# EAGLE design nixieDriver-v1 (EAGLE 5.06)
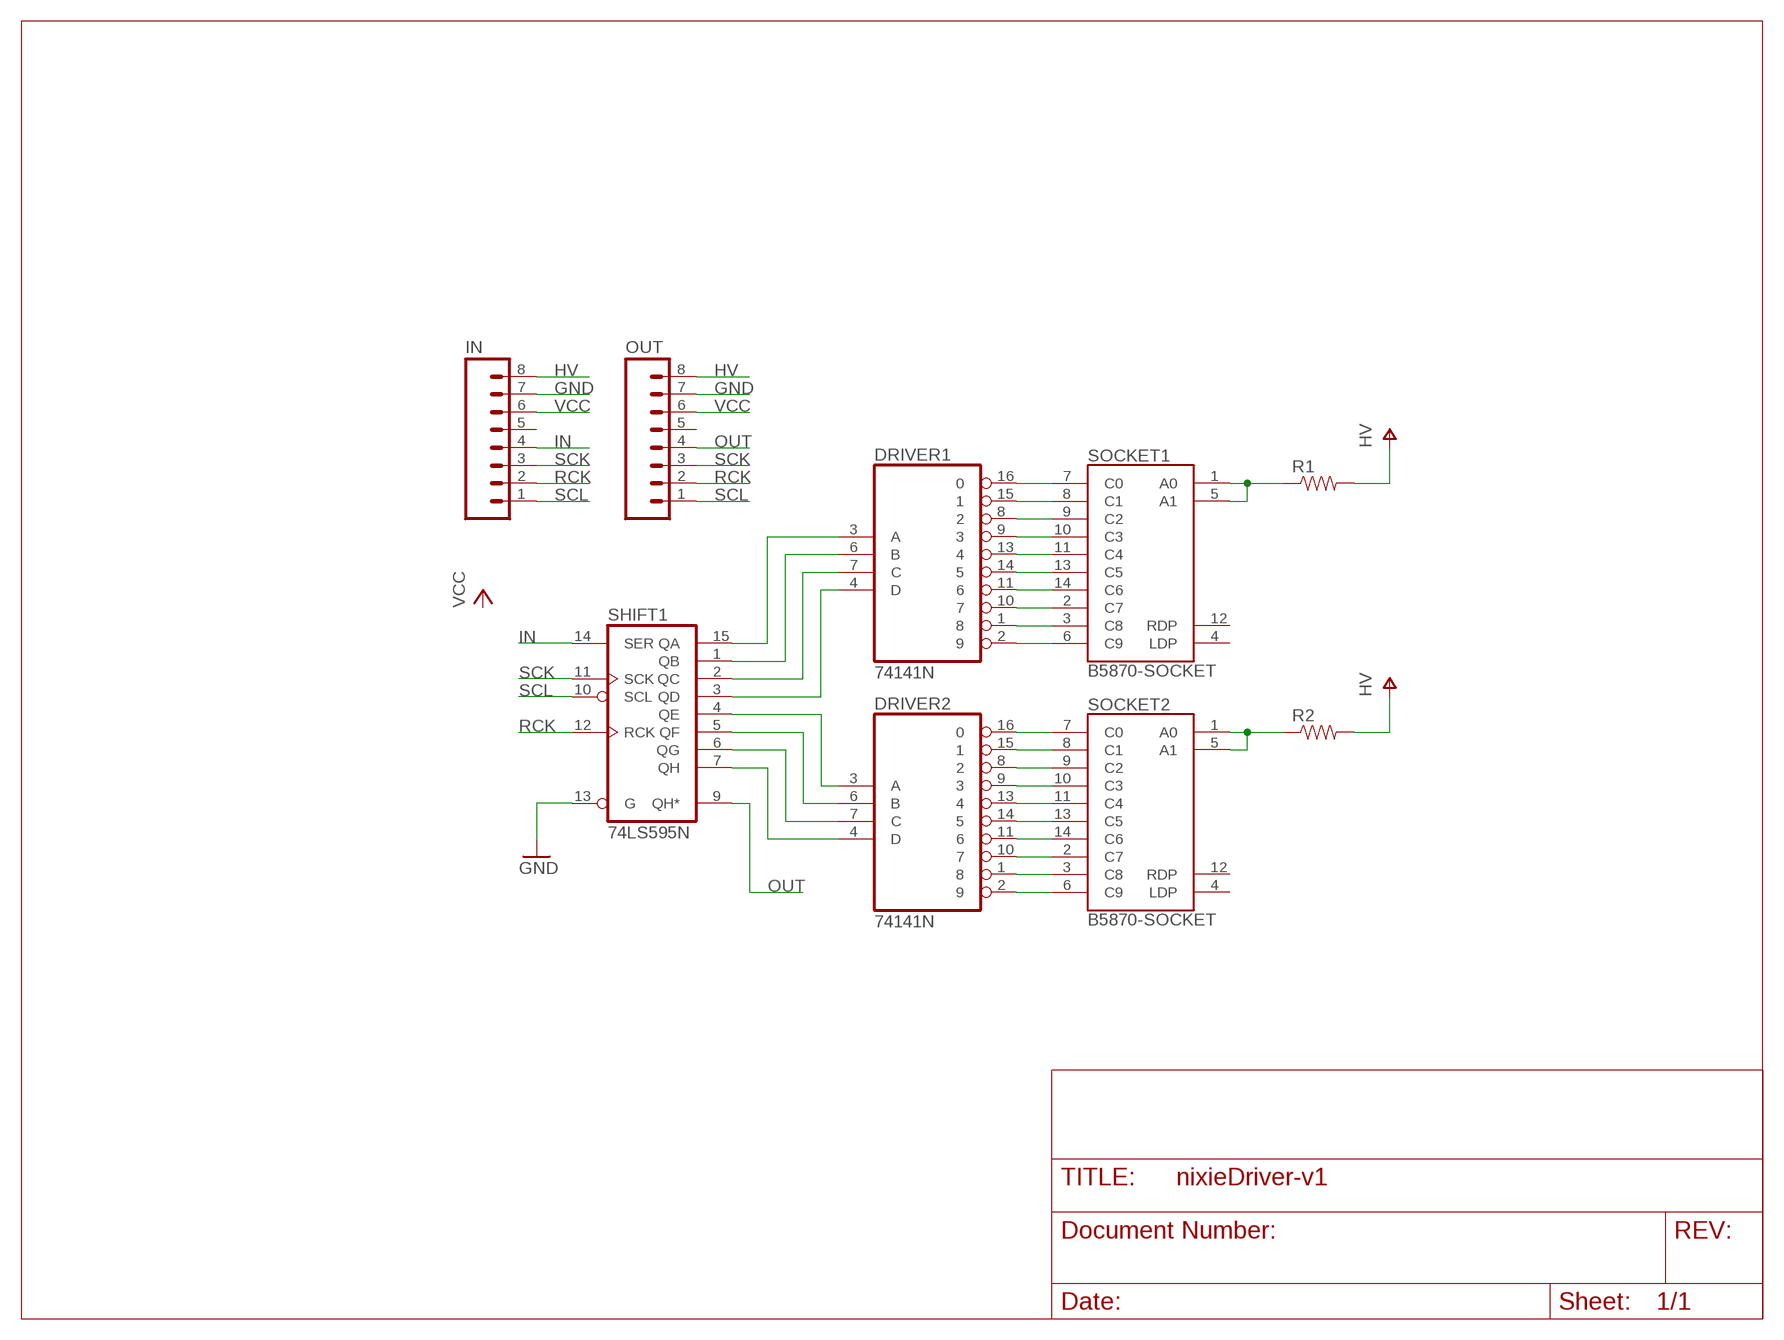
[diagram p0: schematic, sheet 1]

## Parts
DRIVER1  74141N  [DIL16]
DRIVER2  74141N  [DIL16]
IN  M08  [1X08]
OUT  M08  [1X08]
R1  RESISTORPTH1  [AXIAL-0.3]
R2  RESISTORPTH1  [AXIAL-0.3]
SHIFT1  74LS595N  [DIL16]
SOCKET1  B5870-SOCKET  [B5870-SOCKET]
SOCKET2  B5870-SOCKET  [B5870-SOCKET]

## Nets
GND: IN.7 OUT.7 SHIFT1.13(G)
HV: IN.8 OUT.8 R1.P$2 R2.P$2
IN: IN.4 SHIFT1.14(SER)
N$1: DRIVER1.3(A) SHIFT1.15(QA)
N$2: DRIVER1.6(B) SHIFT1.1(QB)
N$3: DRIVER1.7(C) SHIFT1.2(QC)
N$4: DRIVER1.4(D) SHIFT1.3(QD)
N$5: DRIVER2.3(A) SHIFT1.4(QE)
N$6: DRIVER2.6(B) SHIFT1.5(QF)
N$7: DRIVER2.7(C) SHIFT1.6(QG)
N$8: DRIVER2.4(D) SHIFT1.7(QH)
N$9: DRIVER1.16 SOCKET1.7(C0)
N$10: DRIVER1.15 SOCKET1.8(C1)
N$11: DRIVER1.8 SOCKET1.9(C2)
N$12: DRIVER1.9 SOCKET1.10(C3)
N$13: DRIVER1.13 SOCKET1.11(C4)
N$14: DRIVER1.14 SOCKET1.13(C5)
N$15: DRIVER1.11 SOCKET1.14(C6)
N$16: DRIVER1.10 SOCKET1.2(C7)
N$17: DRIVER1.1 SOCKET1.3(C8)
N$18: DRIVER1.2 SOCKET1.6(C9)
N$19: R2.P$1 SOCKET2.1(A0) SOCKET2.5(A1)
N$20: R1.P$1 SOCKET1.1(A0) SOCKET1.5(A1)
N$21: DRIVER2.16 SOCKET2.7(C0)
N$22: DRIVER2.15 SOCKET2.8(C1)
N$23: DRIVER2.8 SOCKET2.9(C2)
N$24: DRIVER2.9 SOCKET2.10(C3)
N$25: DRIVER2.13 SOCKET2.11(C4)
N$26: DRIVER2.14 SOCKET2.13(C5)
N$27: DRIVER2.11 SOCKET2.14(C6)
N$28: DRIVER2.10 SOCKET2.2(C7)
N$29: DRIVER2.1 SOCKET2.3(C8)
N$30: DRIVER2.2 SOCKET2.6(C9)
OUT: OUT.4 SHIFT1.9(QH*)
RCK: IN.2 OUT.2 SHIFT1.12(RCK)
SCK: IN.3 OUT.3 SHIFT1.11(SCK)
SCL: IN.1 OUT.1 SHIFT1.10(SCL)
VCC: IN.6 OUT.6
Unconnected: IN.5 OUT.5 SOCKET1.4(LDP) SOCKET1.12(RDP) SOCKET2.4(LDP) SOCKET2.12(RDP)

## Power pins joined to a net without a drawn wire
GND: DRIVER1.12(GND) DRIVER2.12(GND) SHIFT1.8(GND)
VCC: DRIVER1.5(VCC) DRIVER2.5(VCC) SHIFT1.16(VCC)

## Library data of the parts
DRIVER1 DRIVER2 = 74xx-us:74*141: BCD to decimal DECODER/DRIVER
IN OUT = SparkFun:M08: Header 8 Standard 8-pin 0.1" header. Use with straight break away headers (SKU : PRT-00116), right angle break away headers (PRT-00553), swiss pins (PRT-00743), machine pins (PRT-00117), and female headers (PRT-00115).
R1 R2 = SparkFun:RESISTOR: Resistor Basic schematic elements and footprints for 0603, 1206, and PTH 1/10th watt (small) resistors.
SHIFT1 = 74xx-us:74*595: 8-bit SHIFT REGISTER, output latch
SOCKET1 SOCKET2 = ungood:B5870-SOCKET: Custom-made socket for Burroughs 5870 series Nixie tubes

## Board
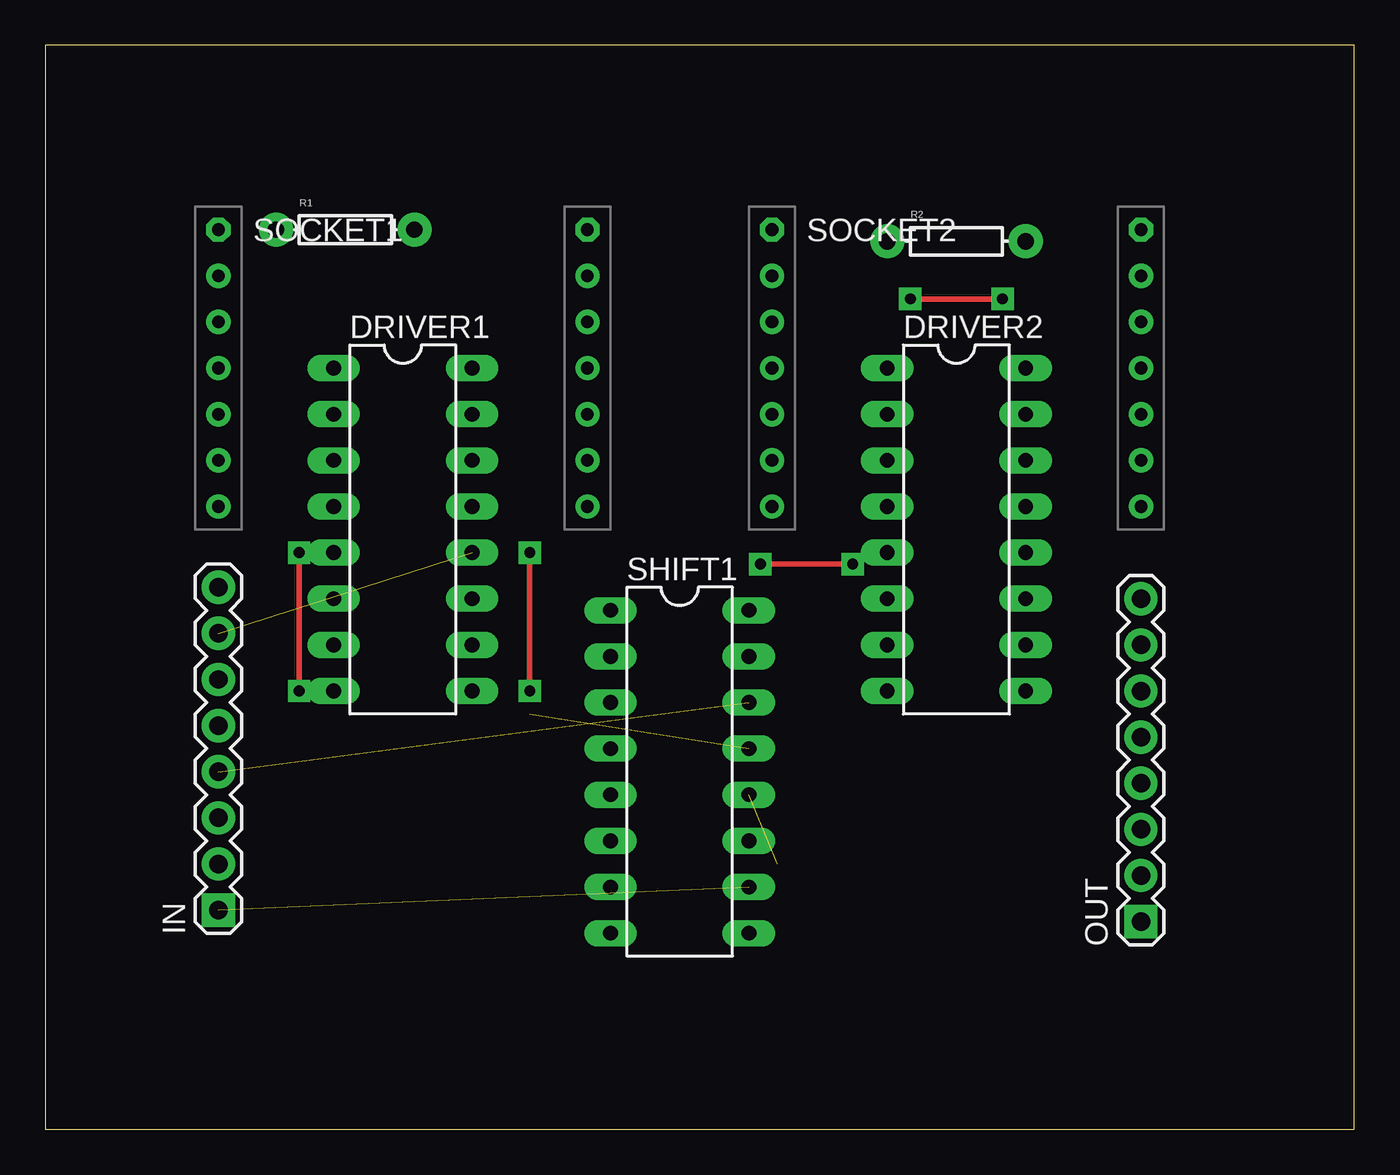
[diagram p1: board, top side]
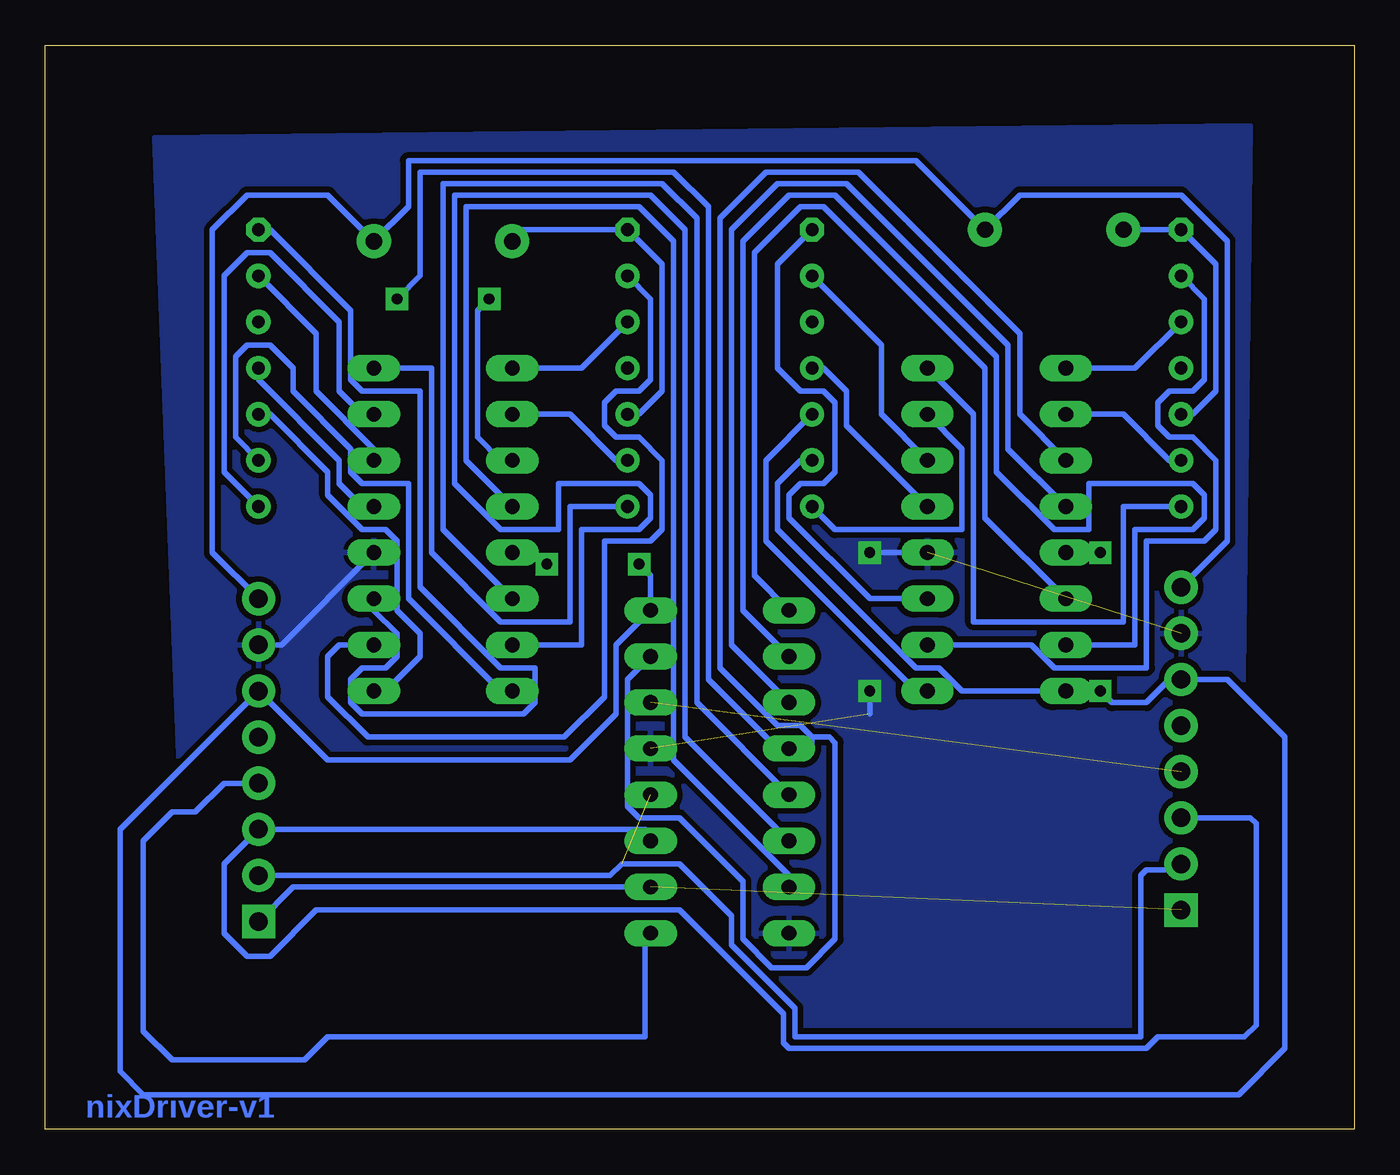
[diagram p2: board, bottom side, seen from below]

Size 72.06 x 59.68 mm. Coordinates in mm from the lower left corner, seen from the top.
Outline: 0,0 72.06,0 72.06,59.68 0,59.68 0,0
Copper layers (1*16): Top 0.035mm / dielectric 1.5mm / Bottom 0.035mm
Design rules "homebrew": minimum track width 12mil, minimum drill 25mil, track to track 12.5mil, track to pad 12.5mil, pad to pad 12.5mil, via to via 12.5mil, smd to smd 8mil, copper to edge 40mil, drill to drill 8mil, minimum pad ring 12.5mil, minimum via ring 12.5mil, stop-mask expansion 4mil, vias tented up to drill 0mil, thermal gap 10mil

### Footprints (pad centres in the part's own frame; a part is rotated, then mirrored left to right if it is on the bottom)
DIL16 = drill 0.813 long: 1 -8.89,-3.81; 2 -6.35,-3.81; 3 -3.81,-3.81; 4 -1.27,-3.81; 5 1.27,-3.81; 6 3.81,-3.81; 7 6.35,-3.81; 8 8.89,-3.81; 9 8.89,3.81; 10 6.35,3.81; 11 3.81,3.81; 12 1.27,3.81; 13 -1.27,3.81; 14 -3.81,3.81; 15 -6.35,3.81; 16 -8.89,3.81
1X08 = drill 1.016 pad 1.829 square: 1 0,0 | drill 1.016 pad 1.829 round: 2 2.54,0; 3 5.08,0; 4 7.62,0; 5 10.16,0; 6 12.7,0; 7 15.24,0; 8 17.78,0
AXIAL-0.3 = drill 0.9 pad 1.88 round: P$1 -3.81,0; P$2 3.81,0
B5870-SOCKET = drill 0.7 octagon: 1 -10.16,7.62; 14 10.16,7.62 | drill 0.7 round: 2 -10.16,5.08; 3 -10.16,2.54; 4 -10.16,0; 5 -10.16,-2.54; 6 -10.16,-5.08; 7 -10.16,-7.62; 8 10.16,-7.62; 9 10.16,-5.08; 10 10.16,-2.54; 11 10.16,0; 12 10.16,2.54; 13 10.16,5.08

### Placement (x,y rotation side)
DRIVER1  19.69,33.02 270 top
DRIVER2  50.16,33.02 270 top
IN  9.53,12.06 90 top
OUT  60.32,11.43 90 top
R1  16.51,49.53 0 top
R2  50.16,48.9 0 top
SHIFT1  34.92,19.69 270 top
SOCKET1  19.69,41.91 0 top
SOCKET2  50.16,41.91 0 top

### Tracks (layer width: path | path; a pad name or v marks a point on that pad's centre or on a via)
GND  (via drill 0.6)  (2 unrouted)
  Top 0.305: v26.67,24.13 v26.67,31.75
  Bottom 0.305: v26.67,31.75 DRIVER1.12 | v26.67,24.13 26.67,22.86 | DRIVER2.12 59.05,26.67 OUT.7
  pour Bottom (isolate 0.305): 5.71,55.24 66.04,54.61 64.14,5.71 6.35,5.71
HV
  Bottom 0.305: IN.8 6.98,32.38 6.98,48.9 9.53,51.43 18.42,51.43 R1.P$2 24.13,53.34 52.07,53.34 52.07,50.8 R2.P$2 56.52,51.43 60.96,51.43 62.86,49.53 62.86,31.75 OUT.8
IN  (1 unrouted)
N$1
  Bottom 0.305: DRIVER1.3 18.42,39.37 18.42,43.82 27.31,52.71 32.38,52.71 34.92,50.16 34.92,25.4 31.75,22.23 30.48,22.23 29.85,21.59 | 29.85,21.59 29.85,21.27 | 29.85,21.59 28.89,21.59 28.58,21.27 28.58,10.48 30.16,8.89 32.07,8.89 33.66,10.48 33.66,13.65 37.15,17.15 39.37,17.15 40,17.78 40,24.77 SHIFT1.15
N$2
  Bottom 0.305: DRIVER1.6 20.32,33.66 20.32,41.91 29.21,50.8 30.48,50.8 33.02,48.26 33.02,30.48 SHIFT1.1
N$3
  Bottom 0.305: DRIVER1.7 12.06,26.67 12.06,33.02 8.89,33.02 8.26,33.66 8.26,34.92 8.89,35.56 14.61,35.56 14.61,33.02 16.51,33.02 19.69,36.2 19.69,42.55 28.58,51.43 31.12,51.43 33.66,48.9 33.66,28.58 SHIFT1.2
N$4
  Bottom 0.305: SHIFT1.3 34.29,26.67 34.29,49.53 31.75,52.07 27.94,52.07 19.05,43.18 19.05,37.46 DRIVER1.4
N$5  (via drill 0.6)
  Top 0.305: v52.7,45.72 v47.62,45.72
  Bottom 0.305: DRIVER2.3 46.99,36.83 48.26,38.1 48.26,45.09 v47.62,45.72 | SHIFT1.4 31.75,20.95 35.56,24.77 35.56,50.8 37.46,52.71 51.43,52.71 51.43,46.99 v52.7,45.72
N$6
  Bottom 0.305: DRIVER2.6 50.16,33.02 50.16,52.07 38.1,52.07 36.2,50.16 36.2,23.49 SHIFT1.5
N$7
  Bottom 0.305: DRIVER2.7 42.54,26.67 42.54,33.02 39.37,33.02 38.73,33.66 38.73,34.92 39.37,35.56 43.81,35.56 43.81,33.02 46.99,33.02 49.53,35.56 49.53,51.43 38.73,51.43 36.83,49.53 36.83,21.59 SHIFT1.6
N$8
  Bottom 0.305: DRIVER2.4 48.89,36.83 48.89,50.8 39.37,50.8 37.46,48.9 37.46,20.32 31.12,13.97 SHIFT1.7
N$9
  Bottom 0.305: SOCKET1.7 12.7,34.29 12.7,27.94 20.96,27.94 20.96,39.37 DRIVER1.16
N$10
  Bottom 0.305: DRIVER1.15 21.59,37.46 21.59,33.02 28.58,33.02 SOCKET1.8
N$11
  Bottom 0.305: SOCKET1.9 30.48,36.83 31.75,35.56 31.75,33.02 24.13,25.4 22.86,25.4 21.59,24.13 DRIVER1.8
N$12
  Bottom 0.305: DRIVER1.9 24.13,24.13 32.38,32.38 32.38,36.83 SOCKET1.10
N$13
  Bottom 0.305: DRIVER1.13 27.94,38.73 27.94,40.64 29.21,41.91 SOCKET1.11
N$14
  Bottom 0.305: DRIVER1.14 26.04,39.37 26.04,43.18 SOCKET1.13
N$15
  Bottom 0.305: SOCKET1.14 31.75,47.62 31.75,41.91 30.48,40.64 29.21,40.64 28.58,40.01 28.58,36.2 29.21,35.56 30.48,35.56 31.12,34.92 31.12,33.66 26.67,29.21 DRIVER1.11
N$16
  Bottom 0.305: SOCKET1.2 8.26,45.72 8.26,41.27 8.89,40.64 10.16,40.64 10.79,40.01 10.79,38.73 10.16,38.1 8.89,38.1 7.62,36.83 7.62,33.02 8.26,32.38 11.43,32.38 11.43,25.4 16.51,25.4 17.78,26.67 DRIVER1.10
N$17
  Bottom 0.305: SOCKET1.3 12.06,41.91 DRIVER1.1
N$18
  Bottom 0.305: SOCKET1.6 10.16,36.83 12.7,39.37 DRIVER1.2
N$19
  Bottom 0.305: SOCKET2.5 39.37,39.37 38.1,40.64 38.1,47.62 SOCKET2.1 45.72,49.53 R2.P$1
N$20
  Bottom 0.305: R1.P$1 SOCKET1.1 7.62,47.62 7.62,40.64 8.89,39.37 SOCKET1.5
N$21
  Bottom 0.305: SOCKET2.7 43.18,34.29 43.18,27.94 46.99,27.94 50.8,31.75 50.8,41.91 DRIVER2.16
N$22
  Bottom 0.305: DRIVER2.15 54.61,39.37 55.88,40.64 55.88,44.45 59.69,48.26 60.96,48.26 62.23,46.99 62.23,36.2 SOCKET2.8
N$23
  Bottom 0.305: SOCKET2.9 61.59,38.1 61.59,42.55 60.96,43.18 59.69,43.18 58.42,41.91 58.42,40.64 55.24,37.46 55.24,36.2 54.61,35.56 52.07,35.56 52.07,29.21 46.99,24.13 DRIVER2.8
N$24
  Bottom 0.305: DRIVER2.9 53.34,24.13 51.43,26.03 51.43,27.3 52.7,28.58 52.7,32.38 53.34,33.02 54.61,33.02 56.52,34.92 56.52,36.2 59.69,39.37 SOCKET2.10
N$25
  Bottom 0.305: DRIVER2.13 54.61,34.29 55.88,35.56 55.88,36.83 60.32,41.27 SOCKET2.11
N$26
  Bottom 0.305: DRIVER2.14 53.98,37.46 57.15,40.64 57.15,43.82 SOCKET2.13
N$27
  Bottom 0.305: DRIVER2.11 53.98,28.58 52.7,27.3 52.7,26.03 53.34,25.4 54.61,25.4 55.24,24.77 55.24,23.49 54.61,22.86 45.72,22.86 45.09,23.49 45.09,25.4 46.99,25.4 51.43,29.84 51.43,40.64 54.61,40.64 55.24,41.27 55.24,45.09 59.69,49.53 SOCKET2.14
N$28
  Bottom 0.305: SOCKET2.2 38.73,45.72 38.73,41.27 39.37,40.64 40.64,40.64 41.27,40.01 41.27,38.73 40.64,38.1 39.37,38.1 38.1,36.83 38.1,33.02 38.73,32.38 41.27,32.38 41.27,23.81 43.5,21.59 54.29,21.59 56.52,23.81 56.52,26.03 55.88,26.67 DRIVER2.10
N$29
  Bottom 0.305: SOCKET2.3 42.54,41.91 DRIVER2.1
N$30
  Bottom 0.305: SOCKET2.6 40.64,36.83 43.18,39.37 DRIVER2.2
OUT
  Bottom 0.305: OUT.4 62.23,19.05 63.82,17.46 65.09,17.46 66.68,15.88 66.68,5.4 65.09,3.81 57.78,3.81 56.52,5.08 39.05,5.08 39.05,10.48 SHIFT1.9
RCK  (1 unrouted)
  Bottom 0.305: OUT.2 40.96,13.97 40.32,14.6 37.15,14.6 34.29,11.75 34.29,10.16 30.8,6.67 30.8,5.08 11.75,5.08 11.75,13.97 11.43,14.29 9.84,14.29 IN.2
SCK
  Bottom 0.305: SHIFT1.11 38.73,16.19 39.05,16.51 OUT.3 62.23,14.6 62.23,10.79 60.96,9.52 59.69,9.52 57.15,12.06 37.15,12.06 31.43,6.35 31.43,4.76 31.12,4.45 11.43,4.45 10.79,5.08 6.03,5.08 5.4,5.71 5.4,16.83 5.71,17.15 IN.3
SCL  (1 unrouted)
  Bottom 0.305: OUT.1 58.42,13.34 SHIFT1.10
VCC  (via drill 0.6)
  Top 0.305: v13.97,24.13 v13.97,31.75 | v39.37,31.12 v44.45,31.12
  Bottom 0.305: v13.97,31.75 DRIVER1.5 | v13.97,24.13 13.33,23.49 11.43,23.49 10.16,24.77 IN.6 6.98,24.77 3.81,21.59 3.81,4.45 6.35,1.91 66.68,1.91 67.95,3.18 67.95,16.51 OUT.6 56.52,20.32 43.18,20.32 40.64,22.86 40.64,26.67 SHIFT1.16 38.73,30.48 v39.37,31.12 | v44.45,31.12 45.09,31.75 DRIVER2.5

### Text on the board
Bottom: nixDriver-v1